# EAGLE schematic vu_esquema (EAGLE 7.2.0)
CDESIGNER: Apellido, Nombre; CNAME: VUMETRO CON ARDUINO; CREVISION: 1.0; CSCHO: EEST N°2
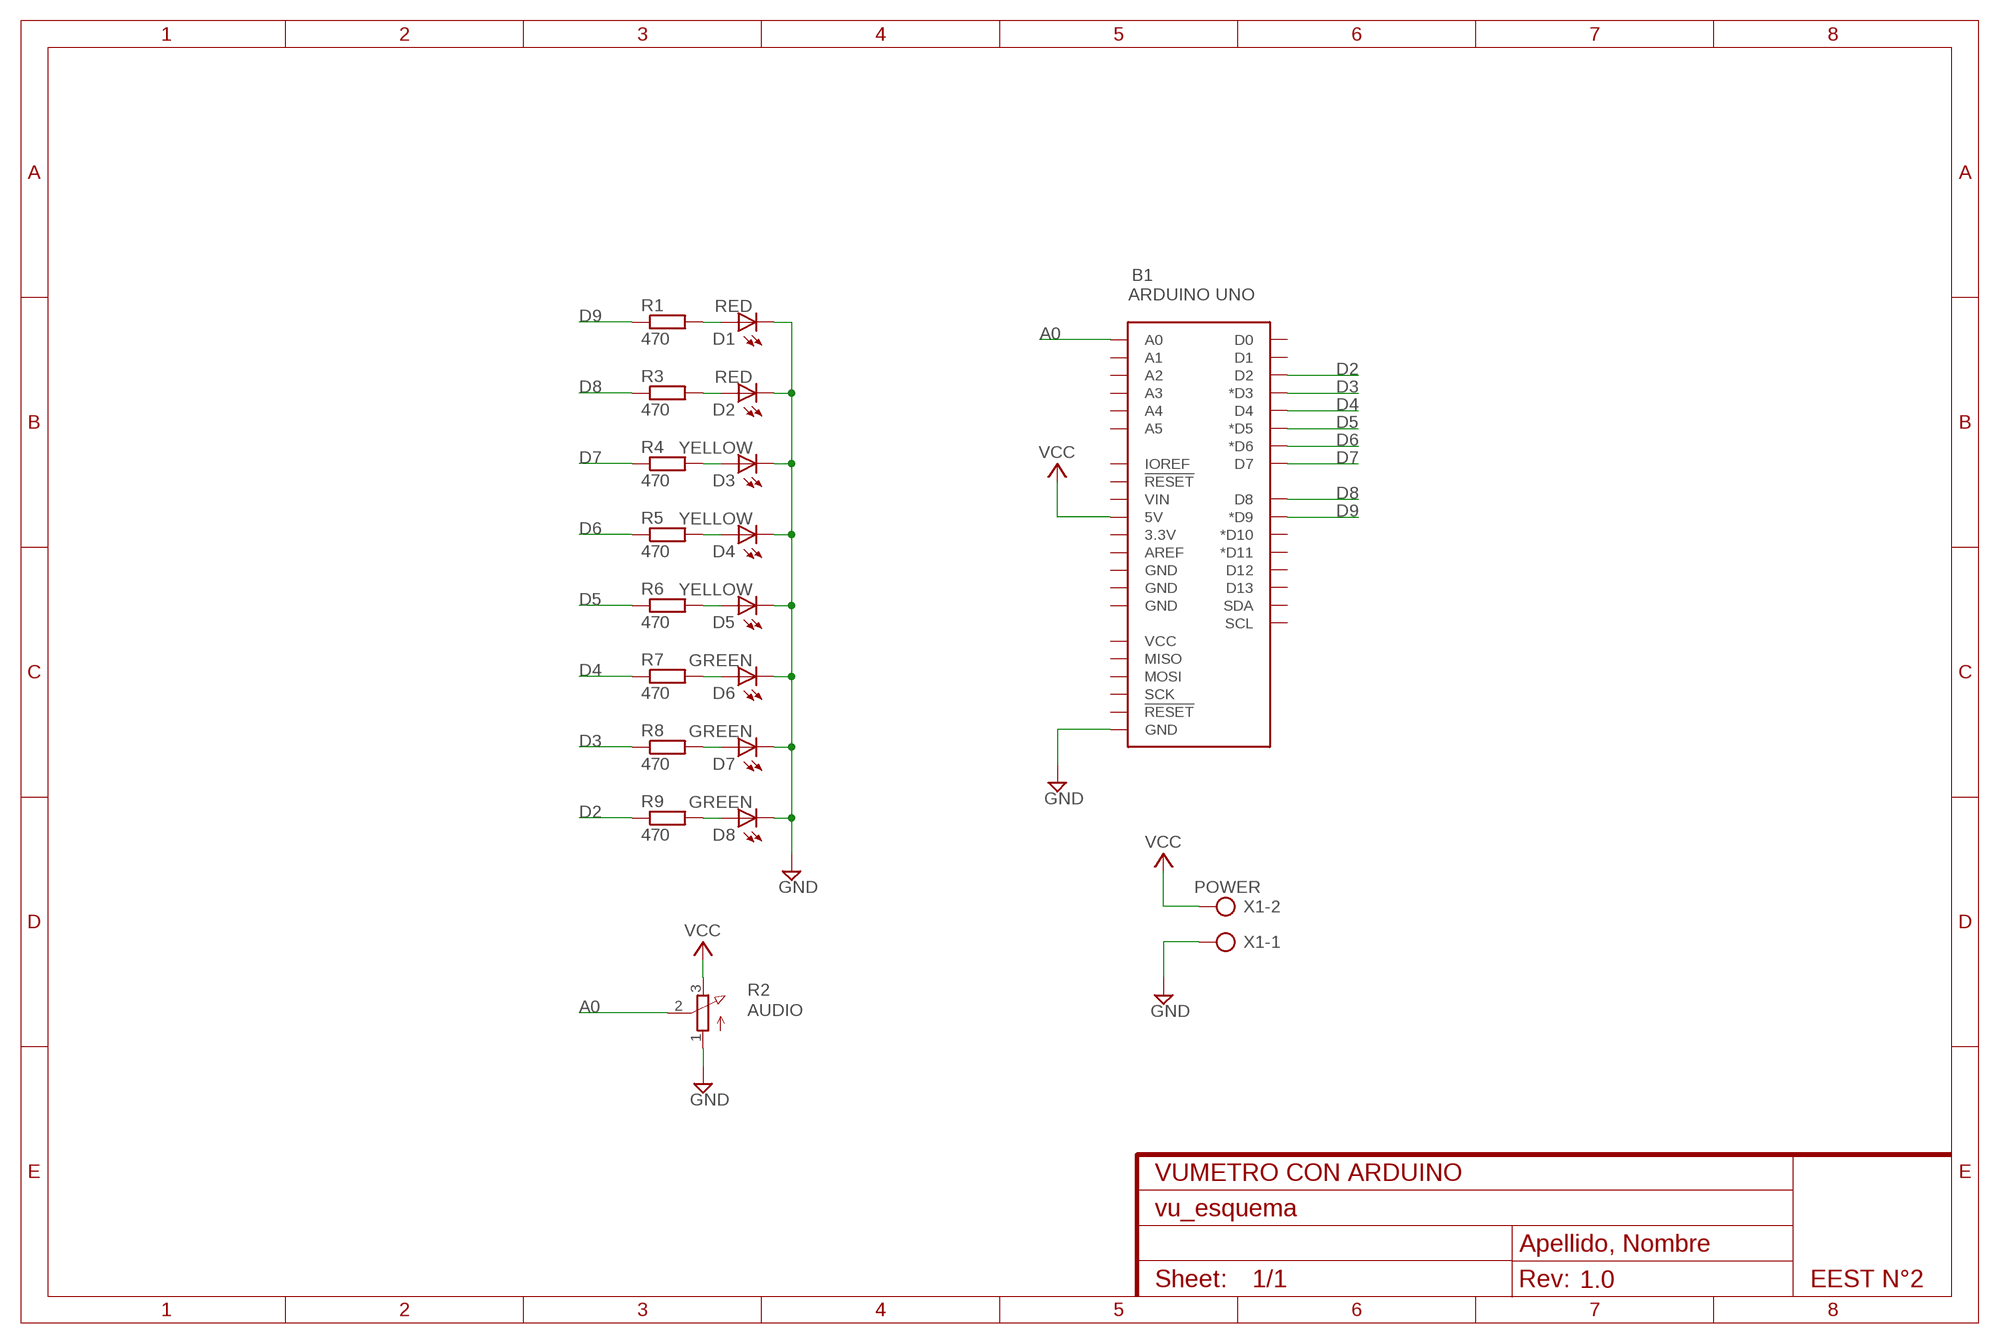
[diagram p0: schematic, sheet 1]

## Parts
B1  ARDUINO UNO  ARDUINO_UNO_R3  [ARDUINO_R3]
D1  RED  LED5MM  [LED_5MM]
D2  RED  LED5MM  [LED_5MM]
D3  YELLOW  LED5MM  [LED_5MM]
D4  YELLOW  LED5MM  [LED_5MM]
D5  YELLOW  LED5MM  [LED_5MM]
D6  GREEN  LED5MM  [LED_5MM]
D7  GREEN  LED5MM  [LED_5MM]
D8  GREEN  LED5MM  [LED_5MM]
R1  470  RESISTOR-EU0204/7  [0204/7]
R2  AUDIO  3RP/1610N  [3RP/1610N]
R3  470  RESISTOR-EU0204/7  [0204/7]
R4  470  RESISTOR-EU0204/7  [0204/7]
R5  470  RESISTOR-EU0204/7  [0204/7]
R6  470  RESISTOR-EU0204/7  [0204/7]
R7  470  RESISTOR-EU0204/7  [0204/7]
R8  470  RESISTOR-EU0204/7  [0204/7]
R9  470  RESISTOR-EU0204/7  [0204/7]
X1  POWER  BORNERA_AK500/2  [AK500/2]

## Nets
A0: B1.A0 R2.2(S)
D2: B1.D2 R9.1
D3: B1.D3(*D3) R8.1
D4: B1.D4 R7.1
D5: B1.D5(*D5) R6.1
D6: B1.D6(*D6) R5.1
D7: B1.D7 R4.1
D8: B1.D8 R3.1
D9: B1.D9(*D9) R1.1
GND: B1.GND@1(GND) D1.K(C) D2.K(C) D3.K(C) D4.K(C) D5.K(C) D6.K(C) D7.K(C) D8.K(C) R2.1(A) X1.1
N$2: D1.A R1.2
N$3: D2.A R3.2
N$4: D3.A R4.2
N$5: D4.A R5.2
N$6: D5.A R6.2
N$7: D6.A R7.2
N$8: D7.A R8.2
N$9: D8.A R9.2
VCC: B1.5V R2.3(E) X1.2
Unconnected: B1.3.3V B1.A1 B1.A2 B1.A3 B1.A4 B1.A5 B1.AREF B1.D0 B1.D1 B1.D10(*D10) B1.D11(*D11) B1.D12 B1.D13 B1.GND@2(GND) B1.GND@3(GND) B1.GND@4(GND) B1.IOREF B1.MISO B1.MOSI B1.RESET@1(!RESET!) B1.RESET@2(!RESET!) B1.SCK B1.SCL B1.SDA B1.VCC B1.VIN

## Library data of the parts
B1 = treser_lib:ARDUINO_UNO_R3: Arduino Uno R3 Arduino Uno R3 Compatible Footprint with SPI header. Matches PCB size of the original board.
D1-D8 = treser_lib:LED: LEDs
R1 R3-R9 = treser_lib:RESISTOR-EU: Resistor Simbolo europeo.
R2 = pot:3RP/1610N: 16mm Potentiometer one level Source: http://www.alphapotentiometers.net/html/16mm_pot_2.html
X1 = treser_lib:BORNERA_AK500/2: Bornera de tornillo; OC_FARNELL: unknown; OC_NEWARK: unknown